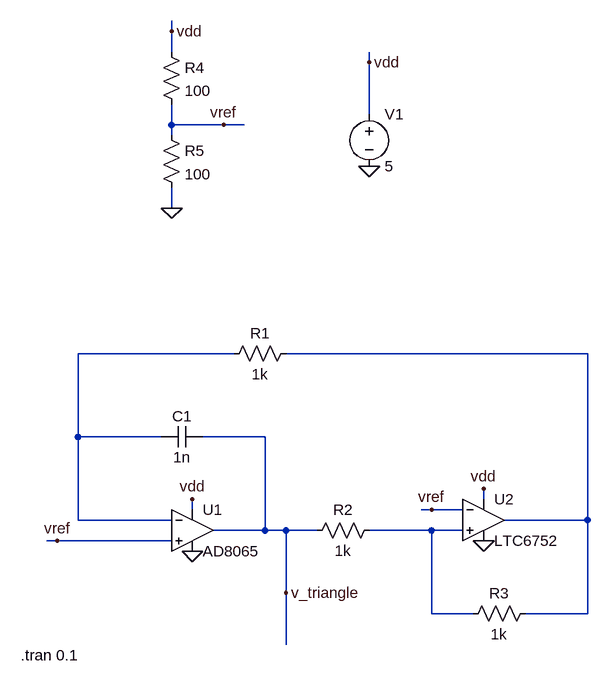
[diagram p0: schematic Draft4.asc]
Draft4.asc, the LTspice schematic file:
Version 4
SHEET 1 880 688
WIRE 208 -384 208 -400
WIRE 208 -352 208 -384
WIRE 512 -336 512 -352
WIRE 512 -256 512 -336
WIRE 208 -240 208 -272
WIRE 288 -240 208 -240
WIRE 320 -240 288 -240
WIRE 208 -224 208 -240
WIRE 208 -112 208 -144
WIRE 304 112 64 112
WIRE 848 112 384 112
WIRE 64 240 64 112
WIRE 192 240 64 240
WIRE 352 240 256 240
WIRE 688 336 688 320
WIRE 240 352 240 336
WIRE 608 352 592 352
WIRE 656 352 608 352
WIRE 64 368 64 240
WIRE 208 368 64 368
WIRE 848 368 848 112
WIRE 848 368 720 368
WIRE 352 384 352 240
WIRE 352 384 272 384
WIRE 384 384 352 384
WIRE 432 384 384 384
WIRE 608 384 512 384
WIRE 656 384 608 384
WIRE 32 400 16 400
WIRE 208 400 32 400
WIRE 384 480 384 384
WIRE 608 512 608 384
WIRE 672 512 608 512
WIRE 848 512 848 368
WIRE 848 512 752 512
WIRE 384 560 384 480
FLAG 208 -112 0
FLAG 240 416 0
FLAG 688 400 0
FLAG 512 -176 0
FLAG 32 400 vref
FLAG 608 352 vref
FLAG 208 -384 vdd
FLAG 288 -240 vref
FLAG 512 -336 vdd
FLAG 384 480 v_triangle
FLAG 240 336 vdd
FLAG 688 320 vdd
SYMBOL res 400 96 R90
WINDOW 0 0 56 VBottom 2
WINDOW 3 32 56 VTop 2
SYMATTR InstName R1
SYMATTR Value 1k
SYMBOL res 528 368 R90
WINDOW 0 0 56 VBottom 2
WINDOW 3 32 56 VTop 2
SYMATTR InstName R2
SYMATTR Value 1k
SYMBOL res 768 496 R90
WINDOW 0 0 56 VBottom 2
WINDOW 3 32 56 VTop 2
SYMATTR InstName R3
SYMATTR Value 1k
SYMBOL cap 256 224 R90
WINDOW 0 0 32 VBottom 2
WINDOW 3 32 32 VTop 2
SYMATTR InstName C1
SYMATTR Value 1n
SYMBOL res 192 -368 R0
SYMATTR InstName R4
SYMATTR Value 100
SYMBOL res 192 -240 R0
SYMATTR InstName R5
SYMATTR Value 100
SYMBOL voltage 512 -272 R0
SYMATTR InstName V1
SYMATTR Value 5
SYMBOL Comparators/LTC6752 688 304 R0
SYMATTR InstName U2
SYMBOL Opamps/AD8065 240 320 R0
SYMATTR InstName U1
TEXT -24 576 Left 2 !.tran 0.1

The netlist it stands for:
* Draft4.asc
R1 N002 N001 1k
R2 N003 v_triangle 1k
R3 N002 N003 1k
C1 v_triangle N001 1n
R4 vdd vref 100
R5 vref 0 100
V1 vdd 0 5
XU2 N003 vref vdd 0 N002 LTC6752  ; pins In+ In- V+ V- OUT
XU1 vref N001 vdd 0 v_triangle AD8065  ; pins In+ In- V+ V- OUT
.tran 0.1
.lib LTC7.lib
.backanno
.end